# Altium schematic sheet CPU-board-Sheet1-multi.SchDoc: SMART METER -CPU Board
size A3; Revision: 0.4; SheetNumber: 1; SheetTotal: 3
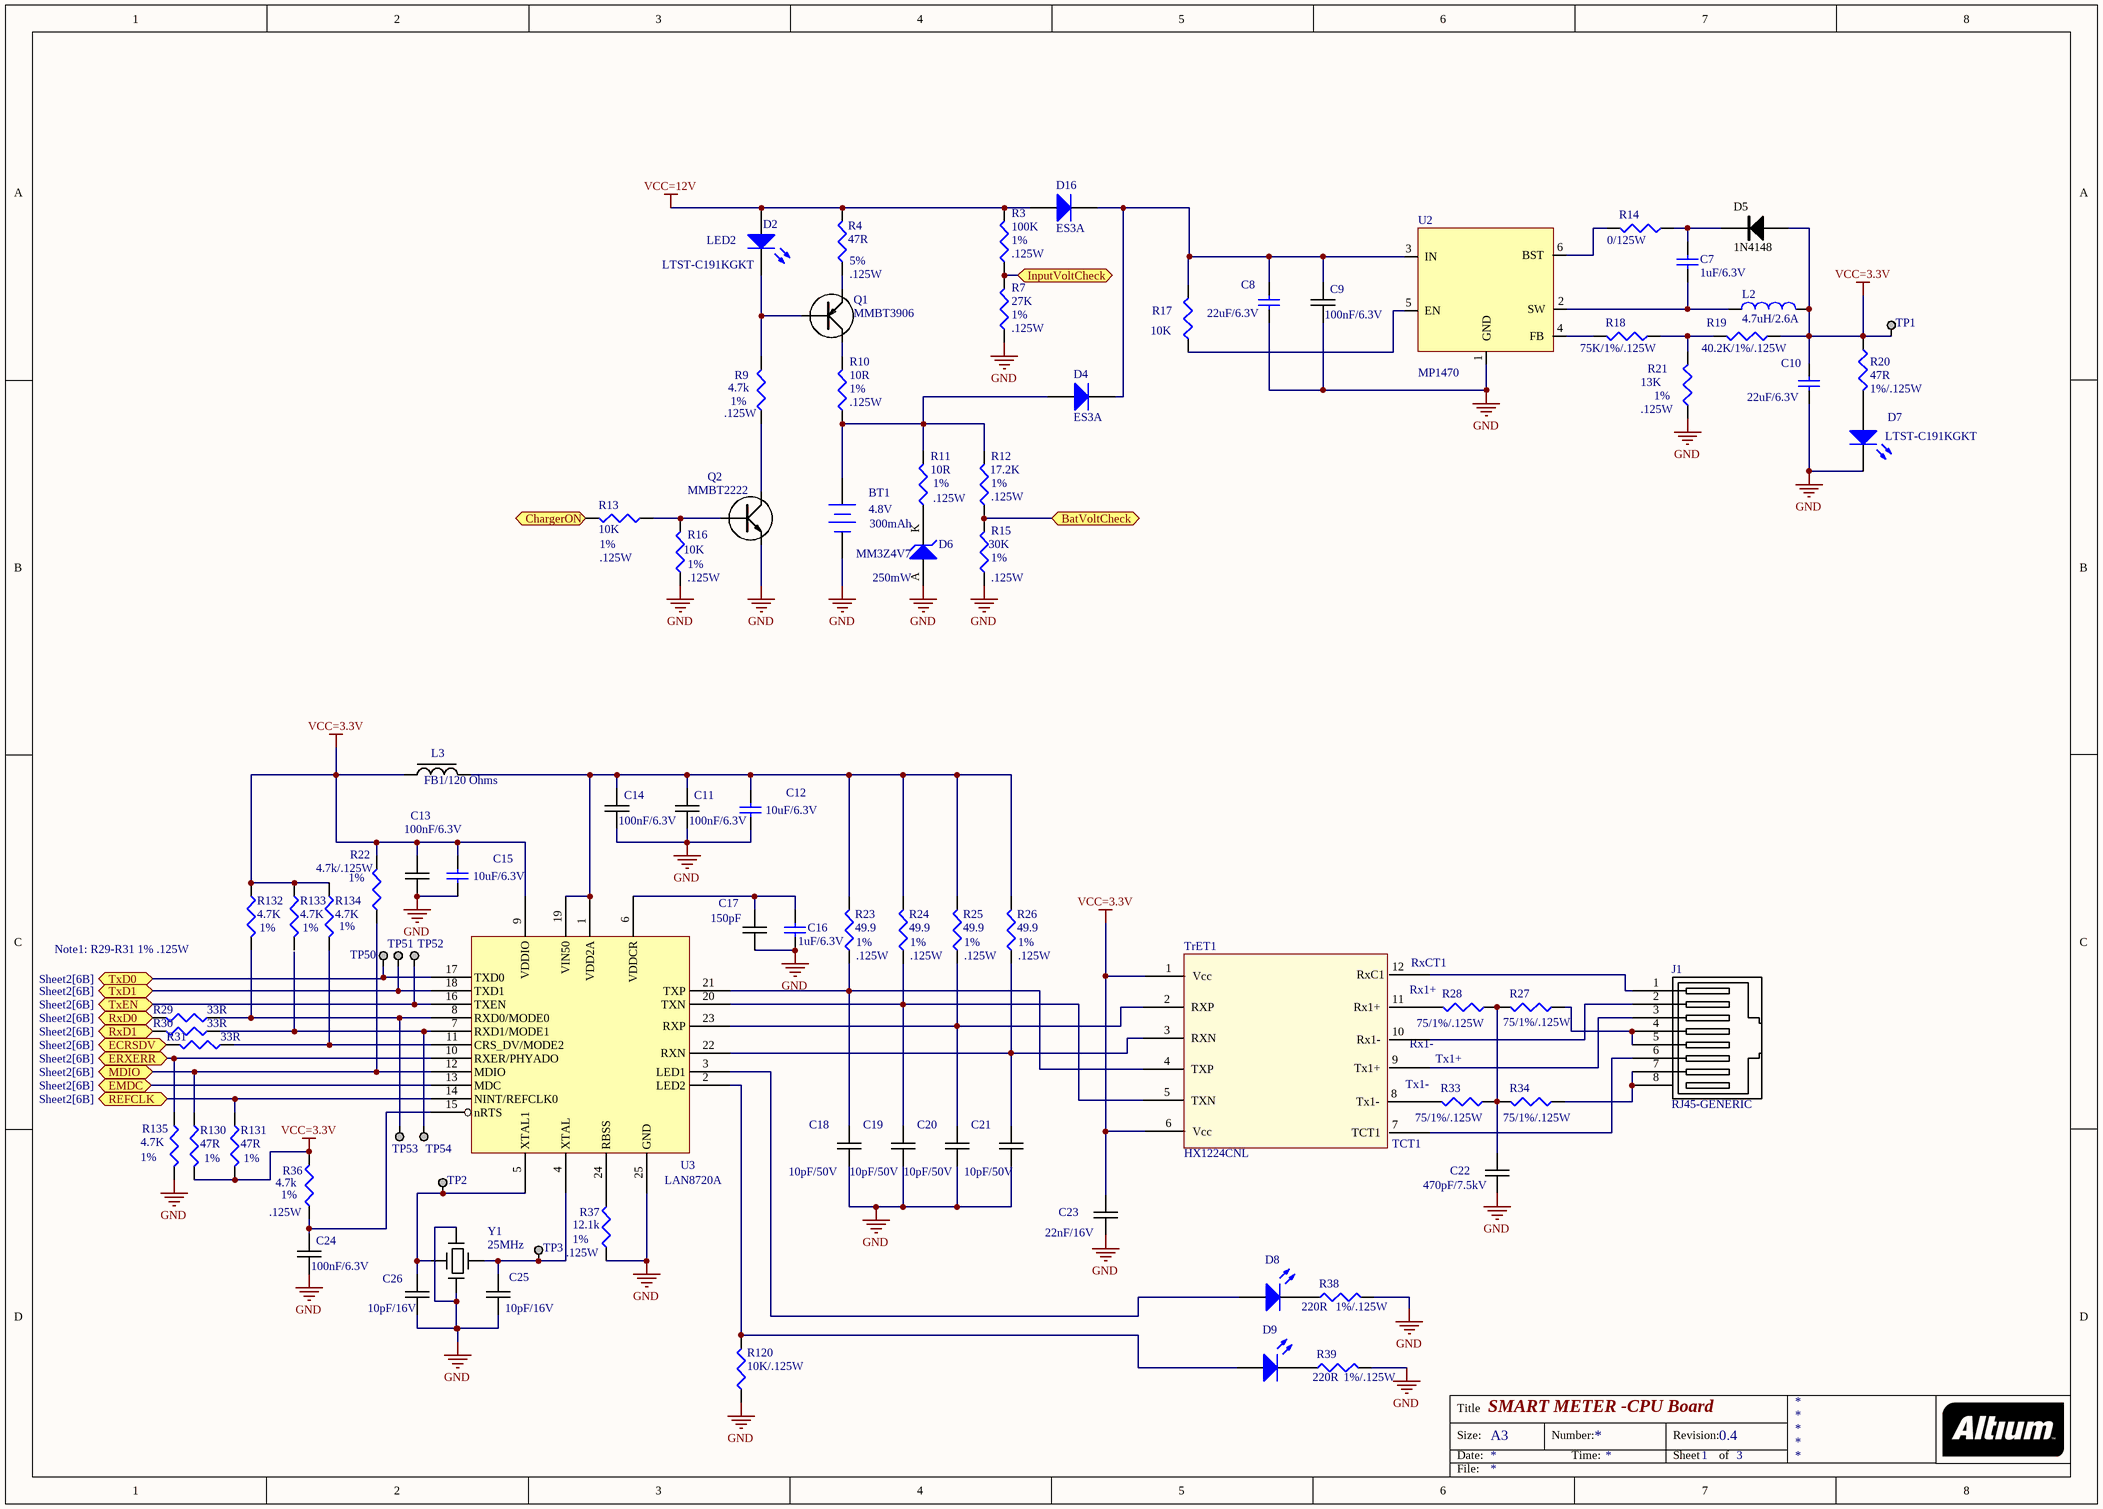
[diagram p0: CPU-board-Sheet1-multi.SchDoc]

## Parts
BT1  4.8V  [BAT-2]
C7  1uF/6.3V  [0402C-GENERIC]
C8  22uF/6.3V  [1206C-GENERIC]
C9  100nF/6.3V  [0402C-GENERIC]
C10  22uF/6.3V  [1206C-GENERIC]
C11  100nF/6.3V  [0402C-GENERIC]
C12  10uF/6.3V  [0402C-GENERIC]
C13  100nF/6.3V  [0402C-GENERIC]
C14  100nF/6.3V  [0402C-GENERIC]
C15  10uF/6.3V  [0402C-GENERIC]
C16  1uF/6.3V  [0402C-GENERIC]
C17  150pF  [0402C-GENERIC]
C18  10pF/50V  [0402C-GENERIC]
C19  10pF/50V  [0402C-GENERIC]
C20  10pF/50V  [0402C-GENERIC]
C21  10pF/50V  [0402C-GENERIC]
C22  470pF/7.5kV  [1808]
C23  22nF/16V  [0402C-GENERIC]
C24  100nF/6.3V  [0402C-GENERIC]
C25  10pF/16V  [0402C-GENERIC]
C26  10pF/16V  [0402C-GENERIC]
D2  LED2  [LED-SM]
D4  ES3A  [DO214AA]
D5  1N4148  [SOD-123]
D6  MM3Z4V7  [SOT23-DIODE]
D7  LED2  [LED-SM]  (value not drawn)
D8  LED2  [LED-SM]  (value not drawn)
D9  LED2  [LED-SM]  (value not drawn)
D16  ES3A  [DO214AA]
J1  RJ45-GENERIC  [RJ45-8/8]
L2  4.7uH/2.6A  [Inductor 4.7/6.8]
L3  FB1/120 Ohms  [0603C-2U2]
Q1  MMBT3906  [SOT23-BCE]
Q2  MMBT2222  [MMBT2222]
R3  100K  [0402R-TBD]
R4  47R  [0402R-TBD]
R7  27K  [0402R-TBD]
R9  4.7k  [0402R-TBD]
R10  10R  [0402R-TBD]
R11  10R  [0402R-TBD]
R12  17.2K  [0402R-TBD]
R13  10K  [0402R-TBD]
R14  0/125W  [0402C-GENERIC]
R15  30K  [0402R-TBD]
R16  10K  [0402R-TBD]
R17  10K  [0402R-TBD]
R18  75K/1%/.125W  [0402C-TBD]
R19  40.2K/1%/.125W  [0402R-TBD]
R20  47R  [0402R-TBD]
R21  13K  [0402R-TBD]
R22  4.7k/.125W  [0402R-TBD]
R23  49.9  [0402R-TBD]
R24  49.9  [0402R-TBD]
R25  49.9  [0402R-TBD]
R26  49.9  [0402R-TBD]
R27  75/1%/.125W  [0402R-TBD]
R28  75/1%/.125W  [0402R-TBD]
R29  33R  [0402R-TBD]
R30  33R  [0402R-TBD]
R31  33R  [0402R-TBD]
R33  75/1%/.125W  [0402R-TBD]
R34  75/1%/.125W  [0402R-TBD]
R36  4.7k  [0402R-TBD]
R37  12.1k  [0402R-TBD]
R38  220R  [0402R-TBD]
R39  220R  [0402R-TBD]
R120  10K/.125W  [0402R-TBD]
R130  47R  [0402R-TBD]
R131  47R  [0402R-TBD]
R132  4.7K  [0402R-TBD]
R133  4.7K  [0402R-TBD]
R134  4.7K  [0402R-TBD]
R135  4.7K  [0402R-TBD]
TP1  TESTPOINT  [TESTPOINT]  (value not drawn)
TP2  TESTPOINT  [TESTPOINT]  (value not drawn)
TP3  TESTPOINT  [TESTPOINT]  (value not drawn)
TP50  TESTPOINT  [TESTPOINT]  (value not drawn)
TP51  TESTPOINT  [TESTPOINT]  (value not drawn)
TP52  TESTPOINT  [TESTPOINT]  (value not drawn)
TP53  TESTPOINT  [TESTPOINT]  (value not drawn)
TP54  TESTPOINT  [TESTPOINT]  (value not drawn)
TrET1  HX1224CNL
U2  MP1470  [MP1470]
U3  LAN8720A  [QFN24_4X4_N]
Y1  25MHz  [CeramicResonator8-16MHZ]

## Ports
BatVoltCheck, ChargerON, ECRSDV (see Sheet2[6B]), EMDC (see Sheet2[6B]), ERXERR (see Sheet2[6B]), InputVoltCheck, MDIO (see Sheet2[6B]), REFCLK (see Sheet2[6B]), RxD0 (see Sheet2[6B]), RxD1 (see Sheet2[6B]), TxD0 (see Sheet2[6B]), TxD1 (see Sheet2[6B]), TxEN (see Sheet2[6B])

## Nets
GND: BT1.2(-) C8.2 C9.2 C10.2 C11.2 C12.2 C13.2 C14.2 C15.2 C16.1 C17.2 C18.2 C19.2 C20.2 C21.2 C22.2 C23.2 C24.2 C25.2 C26.2 D6.A D7.2(K) Q2.E R7.1 R15.1 R16.1 R21.1 R37.1 R38.2 R39.2 R120.1 R135.2 U2.1(GND) U3.25(GND) Y1.2 Y1.4
VCC=3.3V: C10.1 C13.1 C15.1 C23.1 D5.A L2.2 L3.1 R19.1 R20.1 R22.2 R36.2 R130.2 R131.2 R132.1 R133.1 R134.1 TP1.1 TrET1.1(Vcc) TrET1.6(Vcc) U3.9(VDDIO)
VCC=12V: D2.1(A) D16.1(A) R3.2 R4.2
BatVoltCheck: R12.1 R15.2 ; port BatVoltCheck
ChargerON: R13.2 ; port ChargerON
ECRSDV: R31.2 ; port ECRSDV
EMDC: U3.13(MDC) ; port EMDC
ERXERR: R135.1 U3.10(RXER/PHYADO) ; port ERXERR
InputVoltCheck: R3.1 R7.2 ; port InputVoltCheck
MDIO: R22.1 R130.1 U3.12(MDIO) ; port MDIO
REFCLK: R131.1 U3.14(NINT/REFCLK0) ; port REFCLK
RxD0: R29.2 ; port RxD0
RxD1: R30.2 ; port RxD1
TxD0: TP50.1 U3.17(TXD0) ; port TxD0
TxD1: TP51.1 U3.18(TXD1) ; port TxD1
TxEN: TP52.1 U3.16(TXEN) ; port TxEN
NetBT1_1: BT1.1(+) D4.1(A) R10.1 R11.2 R12.2
NetC7_1: C7.1 L2.1 U2.2(SW)
NetC7_2: C7.2 D5.K R14.1
NetC8_1: C8.1 C9.1 D4.2(K) D16.2(K) R17.2 U2.3(IN)
NetC11_1: C11.1 C12.1 C14.1 L3.2 R23.2 R24.2 R25.2 R26.2 U3.1(VDD2A) U3.19(VIN50)
NetC16_2: C16.2 C17.1 U3.6(VDDCR)
NetC18_1: C18.1 R23.1 TrET1.4(TXP) U3.21(TXP)
NetC19_1: C19.1 R24.1 TrET1.5(TXN) U3.20(TXN)
NetC20_1: C20.1 R25.1 TrET1.2(RXP) U3.23(RXP)
NetC21_1: C21.1 R26.1 TrET1.3(RXN) U3.22(RXN)
NetC22_1: C22.1 R27.2 R28.1 R33.1 R34.2
NetC24_1: C24.1 R36.1 U3.15(nRTS)
NetC25_1: C25.1 TP3.1 U3.4(XTAL) Y1.1
NetC26_1: C26.1 TP2.1 U3.5(XTAL1) Y1.3
NetD2_2: D2.2(K) Q1.B R9.2
NetD6_K: D6.K R11.1
NetD7_1: D7.1(A) R20.2
NetD8_1: D8.1(A) U3.3(LED1)
NetD8_2: D8.2(K) R38.1
NetD9_1: D9.1(A) R120.2 U3.2(LED2)
NetD9_2: D9.2(K) R39.1
NetJ1_1: J1.1 TrET1.12(RxC1)
NetJ1_2: J1.2 TrET1.10(Rx1-)
NetJ1_3: J1.3 TrET1.9(Tx1+)
NetJ1_4: J1.4 J1.5 R27.1
NetJ1_6: J1.6 TrET1.7(TCT1)
NetJ1_7: J1.7 J1.8 R34.1
NetQ1_C: Q1.C R10.2
NetQ1_E: Q1.E R4.1
NetQ2_B: Q2.B R13.1 R16.2
NetQ2_C: Q2.C R9.1
NetR14_2: R14.2 U2.6(BST)
NetR17_1: R17.1 U2.5(EN)
NetR18_1: R18.1 R19.2 R21.2
NetR18_2: R18.2 U2.4(FB)
NetR28_2: R28.2 TrET1.11(Rx1+)
NetR29_1: R29.1 R132.2 TP53.1 U3.8(RXD0/MODE0)
NetR30_1: R30.1 TP54.1 U3.7(RXD1/MODE1)
NetR31_1: R31.1 R134.2 U3.11(CRS_DV/MODE2)
NetR33_2: R33.2 TrET1.8(Tx1-)
NetR37_2: R37.2 U3.24(RBSS)

Not connected (* = marked no-connect by the designer): R133 2

## Notes on the sheet
- (near R3) 1%
- (near D2) LTST-C191KGKT
- (near R4) 5%
- (near R4) .125W
- (near R3) .125W
- (near R7) 1%
- (near R7) .125W
- (near R9) .125W
- (near R9) 1%
- (near R10) 1%
- (near R10) .125W
- (near R21) .125W
- (near R21) 1%
- (near R20) 1%/.125W
- (near D7) LTST-C191KGKT
- (near R11) 1%
- (near R11) .125W
- (near R12) 1%
- (near R12) .125W
- (near R13) 1%
- .125W
- (near R16) 1%
- (near R16) .125W
- 300mAh
- (near D6) 250mW
- (near R15) 1%
- (near R15) .125W
- 1%
- Note1: R29-R31 1% .125W
- (near R132) 1%
- (near R134) 1%
- (near R23) 1%
- (near R23) .125W
- (near R24) 1%
- (near R24) .125W
- (near R25) 1%
- (near R25) .125W
- (near R26) 1%
- (near R26) .125W
- Rx1+
- RxCT1
- Rx1-
- Tx1-
- Tx1+
- (near R135) 1%
- (near R130) 1%
- (near R131) 1%
- (near TrET1) TCT1
- (near R36) .125W
- (near R36) 1%
- (near R37) .125W
- (near R38) 1%/.125W
- (near R39) 1%/.125W
- Title
- Size:
- Date:
- A3
- Number:
- Time:
- Revision:
- Sheet
- of
- File:

## Library data of the parts
BT1 = Battery: Multicell Battery; Manufacturer: Guangdong, China (Mainland); Mfr.PN#: 9V-NIMH-01; Published: 24-Mar-1999; LatestRevisionDate: 17-Jul-2002; LatestRevisionNote: Re-released for DXP Platform.; PackageReference: BAT-2; Publisher: sunbangpower.en.alibaba.com; PackageDescription: Battery; 2 Leads; Price: 1; Lik access: *
C7 C16 = Cap: Capacitor; Manufacturer: Murata; Mfr.PN#: GRM155R60J105KE19D; Value: 1uF; Suppl.PN#: 490-1320-1-ND; Published: 8-Jun-2000; LatestRevisionDate: 17-Jul-2002; LatestRevisionNote: Re-released for DXP Platform.; PackageReference: 0402; Publisher: Altium Limited; PackageDescription: Radial Cap, Thru-Hole; 2 Leads; 0.3 in Pin Spacing; Supplier: DigiKey
C8 C10 = Cap: Capacitor; Manufacturer: Murata; Mfr.PN#: GRM31CR60J226KE19L; Value: 100n; Suppl.PN#: 490-1824-2-ND; Published: 8-Jun-2000; LatestRevisionDate: 17-Jul-2002; LatestRevisionNote: Re-released for DXP Platform.; PackageReference: 1206; Publisher: Altium Limited; PackageDescription: Radial Cap, Thru-Hole; 2 Leads; 0.3 in Pin Spacing; Supplier: Digi-Key; Price: .049; Footprint: 0603
C9 C11 C13 C14 C24 = 0805C-18PF-50V-C0G-JOH: CAPACITOR 0805 CERAMIC; mfr PN: LMK105BJ104KV-F; Manufacturer: Taiyo Yuden; Mfr.PN#: CRM155R71H103KA880; Value: 100nF/16V; Suppl.PN#: 587-1227-1-ND; Supplier 1: Digi-Key; Supplier Part Number 1: 709-1171-2-ND; Package reference: 0805-TBD; Supplier: Digi-Key; PackageReference: 0402; Price: .002
C12 C15 = Cap: Capacitor; Manufacturer: Murata; Mfr.PN#: GRM155R60J106ME15D; Suppl.PN#: 490-13238-6-ND; Published: 8-Jun-2000; LatestRevisionDate: 17-Jul-2002; LatestRevisionNote: Re-released for DXP Platform.; PackageReference: 0402; Publisher: Altium Limited; PackageDescription: Radial Cap, Thru-Hole; 2 Leads; 0.3 in Pin Spacing; Value: 10uF/6.3V; Supplier: Digi-Key; Price: .049; Footprint: 0603
C17 = 0805C-18PF-50V-C0G-JOH: CAPACITOR 0805 CERAMIC; Manufacturer: Wurth Electronics; Mfr.PN#: 885012005014; Value: 150pF/10V; Suppl.PN#: 732-7432-1-ND; Supplier 1: Digi-Key; Supplier Part Number 1: 709-1171-2-ND; mfr PN: *; PackageReference: 0402; Supplier: Digi-Key; smd: 0402; Price: .002
C18-C21 = 0805C-18PF-50V-C0G-JOH: CAPACITOR 0805 CERAMIC; Manufacturer: Murata; Mfr.PN#: GRM1555C1H100FA01D; Suppl.PN#: 490-6186-1-ND; Supplier 1: Digi-Key; Supplier Part Number 1: 709-1171-2-ND; Value: 10pF/50V; Supplier: Digi-Key; Price: .03; PackageReference: 0402
C22 = 0805C-18PF-50V-C0G-JOH: CAPACITOR 1808CERAMIC; Manufacturer: Murata; Mfr.PN#: DHRB5AD471M1CB; Value: 470pF; Suppl.PN#: 81-DHRB5AD471M1CB; Supplier 1: Digi-Key; Supplier Part Number 1: 709-1171-2-ND; Supplier: Mouser; PackageReference: 1801; Price: .0096
C23 = 0805C-18PF-50V-C0G-JOH: CAPACITOR 0805 CERAMIC; Manufacturer: Murata Electronics; Mfr.PN#: GRM155R71H223KA12D; Value: 22nF; Suppl.PN#: 490-3884-1-ND; Supplier 1: Digi-Key; Supplier Part Number 1: 709-1171-2-ND; Supplier: 490-5407-6-ND; SMD: 0402; Price: .0096; PackageReference: 0402
C25 C26 = 0805C-18PF-50V-C0G-JOH: CAPACITOR 0805 CERAMIC; Manufacturer: Murata; Mfr.PN#: C0402C100K4GACTU; Value: 10pF/50V; Suppl.PN#: 399-11110-2-ND; Supplier 1: Digi-Key; Supplier Part Number 1: 709-1171-2-ND; Supplier: KEMET; Price: $ 0.34; PackageReference: 0402
D2 D7-D9 = LED2: Typical RED, GREEN, YELLOW, AMBER GaAs LED; Manufacturer: Lite-On Inc; Mfr.PN#: LTST-C191KGKT; Suppl.PN#: 160-1446-2-ND; Published: 8-Jun-2000; LatestRevisionDate: 17-Jul-2002; LatestRevisionNote: Re-released for DXP Platform.; PackageVersion: Feb-2002; PackageReference: 0603; Publisher: Altium Limited; PackageDescription: SM LED; 2 Flat Leads; Supplier: Digi-Key; Price: .04
D4 D16 = Diode 1N4007: 1 Amp General Purpose Rectifier; Manufacturer: Fairchild Co; Suppl.PN#: ES3AFSCT-ND; Published: 8-Jun-2000; LatestRevisionDate: 17-Jul-2002; LatestRevisionNote: Re-released for DXP Platform.; DatasheetVersion: 1998; PackageVersion: Aug-1999; PackageReference: DO-214AC; Publisher: Altium Limited; PackageDescription: Diode, Axial; Body 5.2 x 2.7 mm (LxDia. max), Lead Dia. 0.86 mm (max); Code_JEDEC: DO-204-AL; ComponentLink1Description: Manufacturer Link; ComponentLink1URL: http://www.fairchildsemi.com/; ComponentLink2Description: Datasheet; ComponentLink2URL: http://www.fairchildsemi.com/ds/1N%2F1N4001.pdf; Mfr.PN#: ES3A; Supplier: DigiKey; Price: .142
D5 = 1N4001: Manufacturer: Vishay; Mfr.PN#: 1N4148W-E3-18; Suppl.PN#: 1N4148W-E3-18CT-ND; Supplier: Digikey; PackageReference: SOD-123
D6 = D Zener: Zener Diode; Manufacturer: Fairchild Semi; Mfr.PN#: MM3Z4V7B; Suppl.PN#: MM3Z4V7BCT-ND; Published: 8-Jun-2000; LatestRevisionDate: 17-Jul-2002; LatestRevisionNote: Re-released for DXP Platform.; PackageReference: SOD-323F; Publisher: Altium Limited; PackageDescription: Diode, Thru-Hole; 2 Leads; 0.7 in Pin Spacing; Supplier: DigiKey
J1 = RJ45-GENERIC: GENERIC RJ45 CONNECTOR 8 PIN; Manufacturer: Assman WSW Components; Mfr.PN#: A-2004-2-4-LP-N-R; Suppl.PN#: AE10384-ND; Supplier: DigiKey
L2 = Inductor: Manufacturer: Bourns; Mfr.PN#: SDR7045-6R8M; Code_IEC: 1005; Value: 4.7uH; Suppl.PN#: 490-10791-1-ND; Published: 8-Jun-2000; LatestRevisionDate: 29-May-2009; LatestRevisionNote: IPC-7351 Footprint Added.; PackageReference: 2-SMD; Publisher: Altium Limited; PackageDescription: Chip Inductor; Code_JEITA: 0402; mfr PN: *; Supplier: DigiKey; Price: .82
L3 = 1U-1239AS-TOKO: 1239AS-H-1R0N; Mfr.PN#: BLM18PG121SN1D; Manufacturer: Murata Electronics; Suppl.PN#: 490-1037-1-ND; Supplier: Digi-Key; Price: .288; SMD: look at dsheet; PackageReference: 0603
Q1 = PNP-GENERIC: GENERIC PNP BIPOLAR TRANSISTOR; Manufacturer: On Semi; Mfr.PN#: MMBT3906LT1G; Suppl.PN#: MMBT3906LT1GOSCT-ND; MMBT3906LT1GOSCT-ND: SOT23-3; Supplier: DigiKey; PackageReference: SOT23-3
Q2 = MMBT2222: BC847 SMALL SIGNAL NPN TRANSISTOR; Manufacturer: Diodes  Inc.; Mfr.PN#: MMBT2222A-7-F; Suppl.PN#: MMBT2222A-FDICT-ND; Supplier 1: Digi-Key; Supplier: Digi-Key; PackageReference: SOT-323; Price: .03
R3 = Res3: Resistor; Manufacturer: Panasonic; Mfr.PN#: ERJ-2RKF1003X; Suppl.PN#: P100KLCT-ND; Published: 8-Jun-2000; LatestRevisionDate: 29-May-2009; LatestRevisionNote: IPC-7351 Footprint Added.; PackageReference: 0402; Publisher: Altium Limited; PackageDescription: Chip Resistor; Value: 100K; Supplier: DigiKey; Price: .0035
R4 = Res3: Resistor; mfr PN: ERJ-2RKF47R0X; Manufacrturer: Panasonic; Mfr.PN#: CRCW080545R0FKTA; Value: 45/.125/1%; Suppl.PN#: P47.0LCT-ND; Published: 8-Jun-2000; LatestRevisionDate: 29-May-2009; LatestRevisionNote: IPC-7351 Footprint Added.; PackageReference: 0402; Publisher: Altium Limited; PackageDescription: Chip Resistor; Supplier: Digi-Key
R7 = Res3: Resistor; Manufacturer: Panasonic; Mfr.PN#: ERJ-2RKF2702X; Suppl.PN#: P27.0KLDKR-ND; Published: 8-Jun-2000; LatestRevisionDate: 29-May-2009; LatestRevisionNote: IPC-7351 Footprint Added.; PackageReference: 0402; Publisher: Altium Limited; PackageDescription: Chip Resistor; Value: 27K; Supplier: DigiKey; Price: .0035
R9 R22 R36 = Res3: Resistor; Manufacturer: Panasonic; Mfr.PN#: ERJ-2RKF4701X; Value: 4.7k/ .125W 1%; Suppl.PN#: P4.70KLCT-ND; Published: 8-Jun-2000; LatestRevisionDate: 29-May-2009; LatestRevisionNote: IPC-7351 Footprint Added.; PackageReference: 0402; Publisher: Altium Limited; PackageDescription: Chip Resistor; Supplier: Digi-Key; Price: .1
R10 R11 = Res3: Resistor; Manufacturer: Panasonic; Mfr.PN#: ERJ-2RKF10R0X; Suppl.PN#: P10.0LDKR-ND; Published: 8-Jun-2000; LatestRevisionDate: 29-May-2009; LatestRevisionNote: IPC-7351 Footprint Added.; PackageReference: 0402; Publisher: Altium Limited; PackageDescription: Chip Resistor; Value: 10R; Supplier: DigiKey; Price: .0035
R12 = Res3: Resistor; Manufacturer: Vishay Dale; Mfr.PN#: TNPW040217K2BEED; Value: 57.6K; Suppl.PN#: 541-2080-2-ND; Published: 8-Jun-2000; LatestRevisionDate: 29-May-2009; LatestRevisionNote: IPC-7351 Footprint Added.; PackageReference: 0402; Publisher: Altium Limited; PackageDescription: Chip Resistor; Supplier: DigiKey; Price: .0035
R13 R16 R17 = Res3: Resistor; Manufacturer: Panasonic; Mfr.PN#: ERJ-2RKF1002X; Value: 100K; Suppl.PN#: P10.0KLTR-ND; Published: 8-Jun-2000; LatestRevisionDate: 29-May-2009; LatestRevisionNote: IPC-7351 Footprint Added.; PackageReference: 0402; Publisher: Altium Limited; PackageDescription: Chip Resistor; Supplier: Digi-Key; Price: .0035
R14 = Res3: Resistor; Manufacturer: Vishay Dale; Mfr.PN#: RCA0805100KFKEA; Value: 100K; Suppl.PN#: 541-2230-1-ND; Published: 8-Jun-2000; LatestRevisionDate: 29-May-2009; LatestRevisionNote: IPC-7351 Footprint Added.; PackageReference: 0402; Publisher: Altium Limited; PackageDescription: Chip Resistor; Supplier: Digi-Key; Price: .0035
R15 = Res3: Resistor; Manufacturer: Panasonic; Mfr.PN#: ERJ-2RKF3002X; Value: 33K; Published: 8-Jun-2000; LatestRevisionDate: 29-May-2009; LatestRevisionNote: IPC-7351 Footprint Added.; PackageReference: 0402; Publisher: Altium Limited; PackageDescription: Chip Resistor; Supplier: DigiKey; Price: .0035
R18 = Res3: Resistor; Manufacturer: Panasonic; Mfr.PN#: ERJ-2GEJ753X; Value: 75K; Suppl.PN#: P75KJDKR-ND; Published: 8-Jun-2000; LatestRevisionDate: 29-May-2009; LatestRevisionNote: IPC-7351 Footprint Added.; PackageReference: 0402; Publisher: Altium Limited; PackageDescription: Chip Resistor; Supplier: Digikey; Price: .0035
R19 = Res3: Resistor; Manufacturer: Panasonic; Mfr.PN#: ERJ-2RKF4022X; Value: 100K; Suppl.PN#: P40.2KLCT-ND; Published: 8-Jun-2000; LatestRevisionDate: 29-May-2009; LatestRevisionNote: IPC-7351 Footprint Added.; PackageReference: 0402; Publisher: Altium Limited; PackageDescription: Chip Resistor; Supplier: DigiKey; Price: .0035
R20 = Res3: Resistor; mfr PN: ERJ-2RKF47R0X; Manufacrturer: Panasonic; Mfr.PN#: ERJ-6ENF47R0V; Value: 45/.125/1%; Suppl.PN#: P47.0LCT-ND; Published: 8-Jun-2000; LatestRevisionDate: 29-May-2009; LatestRevisionNote: IPC-7351 Footprint Added.; PackageReference: 0402; Publisher: Altium Limited; PackageDescription: Chip Resistor; Supplier: Digi-Key
R21 = Res3: Resistor; Manufacturer: Panasonic; Mfr.PN#: ERJ-2RKF1302X; Suppl.PN#: P13.0KLCT-ND; Published: 8-Jun-2000; LatestRevisionDate: 29-May-2009; LatestRevisionNote: IPC-7351 Footprint Added.; PackageReference: 0402; Publisher: Altium Limited; PackageDescription: Chip Resistor; Value: 13K; Supplier: DigiKey; Price: .0035
R23-R26 = Res3: Resistor; Manufacturer: Panasonic; Mfr.PN#: ERJ-2RKF49R9X; Value: 49.9 .125W 1%; Suppl.PN#: P49.9LCT-ND; Published: 8-Jun-2000; LatestRevisionDate: 29-May-2009; LatestRevisionNote: IPC-7351 Footprint Added.; PackageReference: 0402; Publisher: Altium Limited; PackageDescription: Chip Resistor; Supplier: Digi-Key; Price: .0026
R27 R28 R33 R34 = Res3: Resistor; Manufacturer: Panasonic; Mfr.PN#: ERJ-2RKF75R0X; Value: 75 1% .125; Suppl.PN#: P75.0LCT-ND; Published: 8-Jun-2000; LatestRevisionDate: 29-May-2009; LatestRevisionNote: IPC-7351 Footprint Added.; PackageReference: 0402; Publisher: Altium Limited; PackageDescription: Chip Resistor; Supplier: Digi-Key; Price: .0026
R29-R31 = Res3: Resistor; Manufacturer: Panasonic; Mfr.PN#: ERJ-PA2F33R0X; Value: 33R 125W 1%; Suppl.PN#: P17215TR-ND; Published: 8-Jun-2000; LatestRevisionDate: 29-May-2009; LatestRevisionNote: IPC-7351 Footprint Added.; PackageReference: 0402; Publisher: Altium Limited; PackageDescription: Chip Resistor; Supplier: Digi-Key; Price: .1
R37 = Res3: Resistor; Manufacturer: Panasonic; Mfr.PN#: ERJ-2RKF1212X; Value: 12.1k/ .125W 1%; Suppl.PN#: P12.1KLCT-ND; Published: 8-Jun-2000; LatestRevisionDate: 29-May-2009; LatestRevisionNote: IPC-7351 Footprint Added.; PackageReference: 0402; Publisher: Altium Limited; PackageDescription: Chip Resistor; Supplier: Digi-Key; Price: .1
R38 R39 = Res3: Resistor; Manufacturer: Panasonic; Mfr.PN#: ERJ-2RKF1001X; Value: 1K; Suppl.PN#: P1.00KLCT-ND; Published: 8-Jun-2000; LatestRevisionDate: 29-May-2009; LatestRevisionNote: IPC-7351 Footprint Added.; PackageReference: 0402; Publisher: Altium Limited; PackageDescription: Chip Resistor; Supplier: DigiKey; Price: .0035
R120 = Res3: Resistor; Manufacturer: Panasonic; Mfr.PN#: ERJ-2GEJ103X; Value: 10K .125W 1%; Suppl.PN#: P10KJCT-ND; Published: 8-Jun-2000; LatestRevisionDate: 29-May-2009; LatestRevisionNote: IPC-7351 Footprint Added.; PackageReference: 0402; Publisher: Altium Limited; PackageDescription: Chip Resistor; Supplier: Digi-Key; Price: .0026
R130 R131 = Res3: Resistor; Manufacturer: Panasonic; Mfr.PN#: ERJ-2RKF47R0X; Value: 47R 125W 1%; Suppl.PN#: P47.0LDKR-ND; Published: 8-Jun-2000; LatestRevisionDate: 29-May-2009; LatestRevisionNote: IPC-7351 Footprint Added.; PackageReference: 0402; Publisher: Altium Limited; PackageDescription: Chip Resistor; Supplier: Digi-Key; Price: .1
R132-R135 = Res3: Resistor; Manufacturer: Panasonic; Mfr.PN#: ERJ-2RKF4701X; Value: 4.7K125W 1%; Suppl.PN#: P4.70KLTR-ND; Published: 8-Jun-2000; LatestRevisionDate: 29-May-2009; LatestRevisionNote: IPC-7351 Footprint Added.; PackageReference: 0402; Publisher: Altium Limited; PackageDescription: Chip Resistor; Supplier: Digi-Key; Price: .1
TP1-TP3 TP50-TP54 = TESTPOINT: TESTPOINT SCOPE GRABBER; Manufacturer Part Number: 5010; Manufacturer: Keystone Electronics; Reel: TH; Supplier 1: Digi-Key; Supplier Part Number 1: 5010K-ND
TrET1 = hx1224nl
U2 = MP1470: Manufacturer: MPS Inc; Mfr.PN#: MP1470GJ-P; Suppl.PN#: 1589-1018-1-ND; Supplier: DigiKey; PackageReference: TSOT-23-6
U3 = LAN8720: Manufacturer: Microchip; Mfr.PN#: LAN8720A-CP-TR; Suppl.PN#: LAN8720A-CP-CT-ND; Supplier: Digi-key; Price: .76; PackageReference: 24 QFN
Y1 = 12MC-HC49US-7MM: 25MHz CRYSTAL HC49US SHORT BODY; Manufacturer: KDS DAISHINKU.Corp; Mfr.PN#: DSX321SH-25MHz; Supplier 1: Mouser; Supplier Part Number 1: 520-120-20-3XT; Link access: www.kds.info/product; Supplier: KDS DAISHINKU.Corp; Suppl.PN#: DSX321SH-25MHz